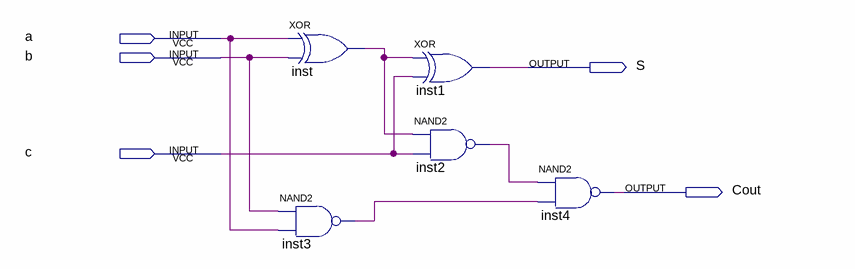
[diagram p0: schematic sheet]
// Quartus schematic fulladder.bdf as structural Verilog: 5 symbols, 5 pins
module fulladder (
  input  a,
  input  b,
  input  c,
  output S,
  output Cout
);

  wire inst2_out, inst3_out, inst_out;

  xor inst (inst_out, a, b);
  nand inst3 (inst3_out, b, a);
  xor inst1 (S, inst_out, c);
  nand inst2 (inst2_out, inst_out, c);
  nand inst4 (Cout, inst2_out, inst3_out);
endmodule
